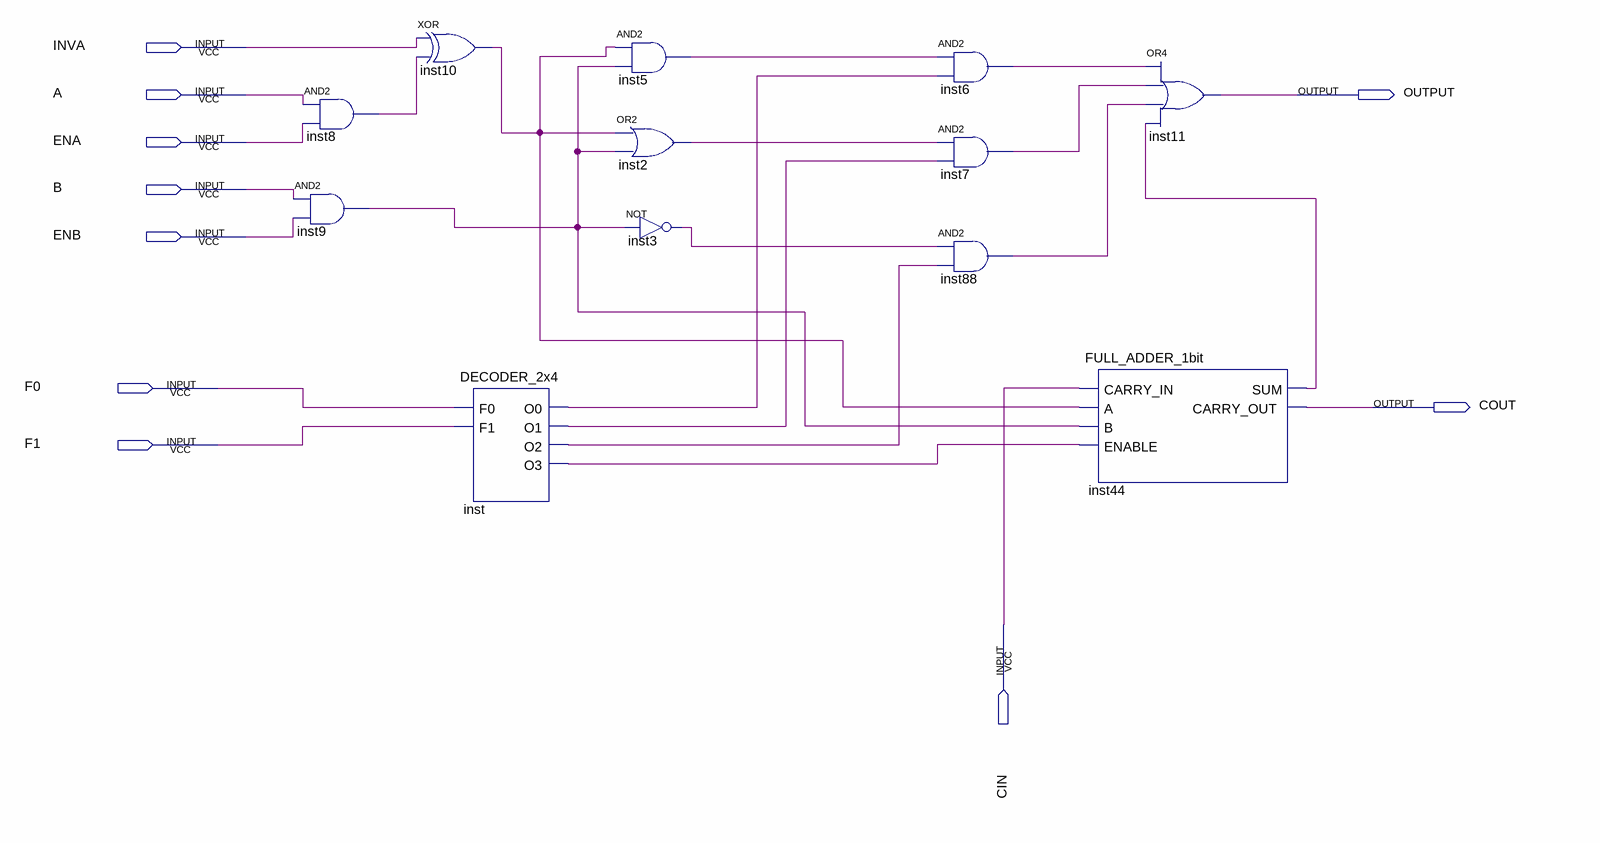
[diagram p0: schematic sheet]
// Quartus schematic ULA_1BIT.bdf as structural Verilog: 12 symbols, 10 pins
module ULA_1BIT (
  input  INVA,
  input  A,
  input  ENA,
  input  B,
  input  ENB,
  input  F0,
  input  F1,
  input  CIN,
  output OUTPUT,
  output COUT
);

  wire inst2_out, inst3_out, inst5_out, inst6_out, inst7_out, inst8_out, inst9_out, inst10_out, inst44_sum,
       inst88_out, inst_o0, inst_o1, inst_o2, inst_o3;

  and inst9 (inst9_out, B, ENB);
  and inst8 (inst8_out, A, ENA);
  xor inst10 (inst10_out, INVA, inst8_out);
  DECODER_2x4 inst (.F0(F0), .F1(F1), .O0(inst_o0), .O1(inst_o1), .O2(inst_o2), .O3(inst_o3));
  and inst5 (inst5_out, inst10_out, inst9_out);
  or inst2 (inst2_out, inst10_out, inst9_out);
  not inst3 (inst3_out, inst9_out);
  and inst6 (inst6_out, inst5_out, inst_o0);
  and inst7 (inst7_out, inst2_out, inst_o1);
  and inst88 (inst88_out, inst3_out, inst_o2);
  FULL_ADDER_1bit inst44 (
    .CARRY_IN(CIN), .A(inst10_out), .B(inst9_out), .ENABLE(inst_o3), .SUM(inst44_sum), .CARRY_OUT(COUT));
  or inst11 (OUTPUT, inst6_out, inst7_out, inst88_out, inst44_sum);
endmodule
